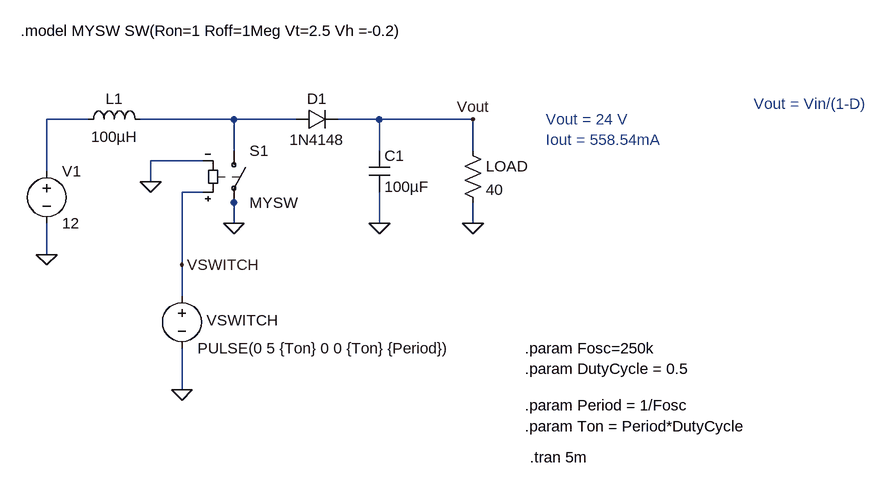
[diagram p0: schematic Boost (Step-UP) Converter Design.asc]
Boost (Step-UP) Converter Design.asc, the LTspice schematic file:
Version 4
SHEET 1 1332 680
WIRE 64 96 0 96
WIRE 288 96 144 96
WIRE 384 96 288 96
WIRE 512 96 448 96
WIRE 656 96 512 96
WIRE 288 144 288 96
WIRE 512 144 512 96
WIRE 656 144 656 96
WIRE 240 160 160 160
WIRE 0 176 0 96
WIRE 160 192 160 160
WIRE 240 208 208 208
WIRE 288 224 288 208
WIRE 288 256 288 224
WIRE 512 256 512 208
WIRE 656 256 656 224
WIRE 0 304 0 256
WIRE 208 320 208 208
WIRE 208 368 208 320
WIRE 208 512 208 448
FLAG 0 304 0
FLAG 160 192 0
FLAG 208 512 0
FLAG 288 256 0
FLAG 512 256 0
FLAG 656 256 0
FLAG 656 96 Vout
FLAG 208 320 VSWITCH
SYMBOL voltage 0 160 R0
WINDOW 123 0 0 Left 0
WINDOW 39 0 0 Left 0
SYMATTR InstName V1
SYMATTR Value 12
SYMBOL sw 288 128 R0
SYMATTR InstName S1
SYMATTR Value MYSW
SYMBOL voltage 208 352 R0
WINDOW 0 38 53 Left 2
WINDOW 123 0 0 Left 0
WINDOW 39 0 0 Left 0
SYMATTR InstName VSWITCH
SYMATTR Value PULSE(0 5 {Ton} 0 0 {Ton} {Period})
SYMBOL ind 48 112 R270
WINDOW 0 32 56 VTop 2
WINDOW 3 5 56 VBottom 2
SYMATTR InstName L1
SYMATTR Value 100µH
SYMBOL diode 384 112 R270
WINDOW 0 32 32 VTop 2
WINDOW 3 0 32 VBottom 2
SYMATTR InstName D1
SYMATTR Value 1N4148
SYMBOL cap 496 144 R0
SYMATTR InstName C1
SYMATTR Value 100µF
SYMBOL res 640 128 R0
SYMATTR InstName LOAD
SYMATTR Value 40
TEXT 736 448 Left 2 !.param Fosc=250k
TEXT 736 480 Left 2 !.param DutyCycle = 0.5
TEXT 736 536 Left 2 !.param Period = 1/Fosc
TEXT 736 568 Left 2 !.param Ton = Period*DutyCycle
TEXT 744 616 Left 2 !.tran 5m
TEXT -40 -40 Left 2 !.model MYSW SW(Ron=1 Roff=1Meg Vt=2.5 Vh =-0.2)
TEXT 768 96 Left 2 ;Vout = 24 V\nIout = 558.54mA
TEXT 1088 72 Left 2 ;Vout = Vin/(1-D)

The netlist it stands for:
* Boost (Step-UP) Converter Design.asc
V1 N001 0 12
S1 N002 0 VSWITCH 0 MYSW
VSWITCH VSWITCH 0 PULSE(0 5 {Ton} 0 0 {Ton} {Period})
L1 N001 N002 100µH
D1 N002 Vout 1N4148
C1 Vout 0 100µF
R§LOAD Vout 0 40
.model D D
.lib standard.dio
.param Fosc=250k
.param DutyCycle = 0.5
.param Period = 1/Fosc
.param Ton = Period*DutyCycle
.tran 5m
.model MYSW SW(Ron=1 Roff=1Meg Vt=2.5 Vh =-0.2)
* Vout = 24 V
* Iout = 558.54mA
* Vout = Vin/(1-D)
.backanno
.end